# EAGLE schematic 2020can_slave_v3 (EAGLE 9.6.2)
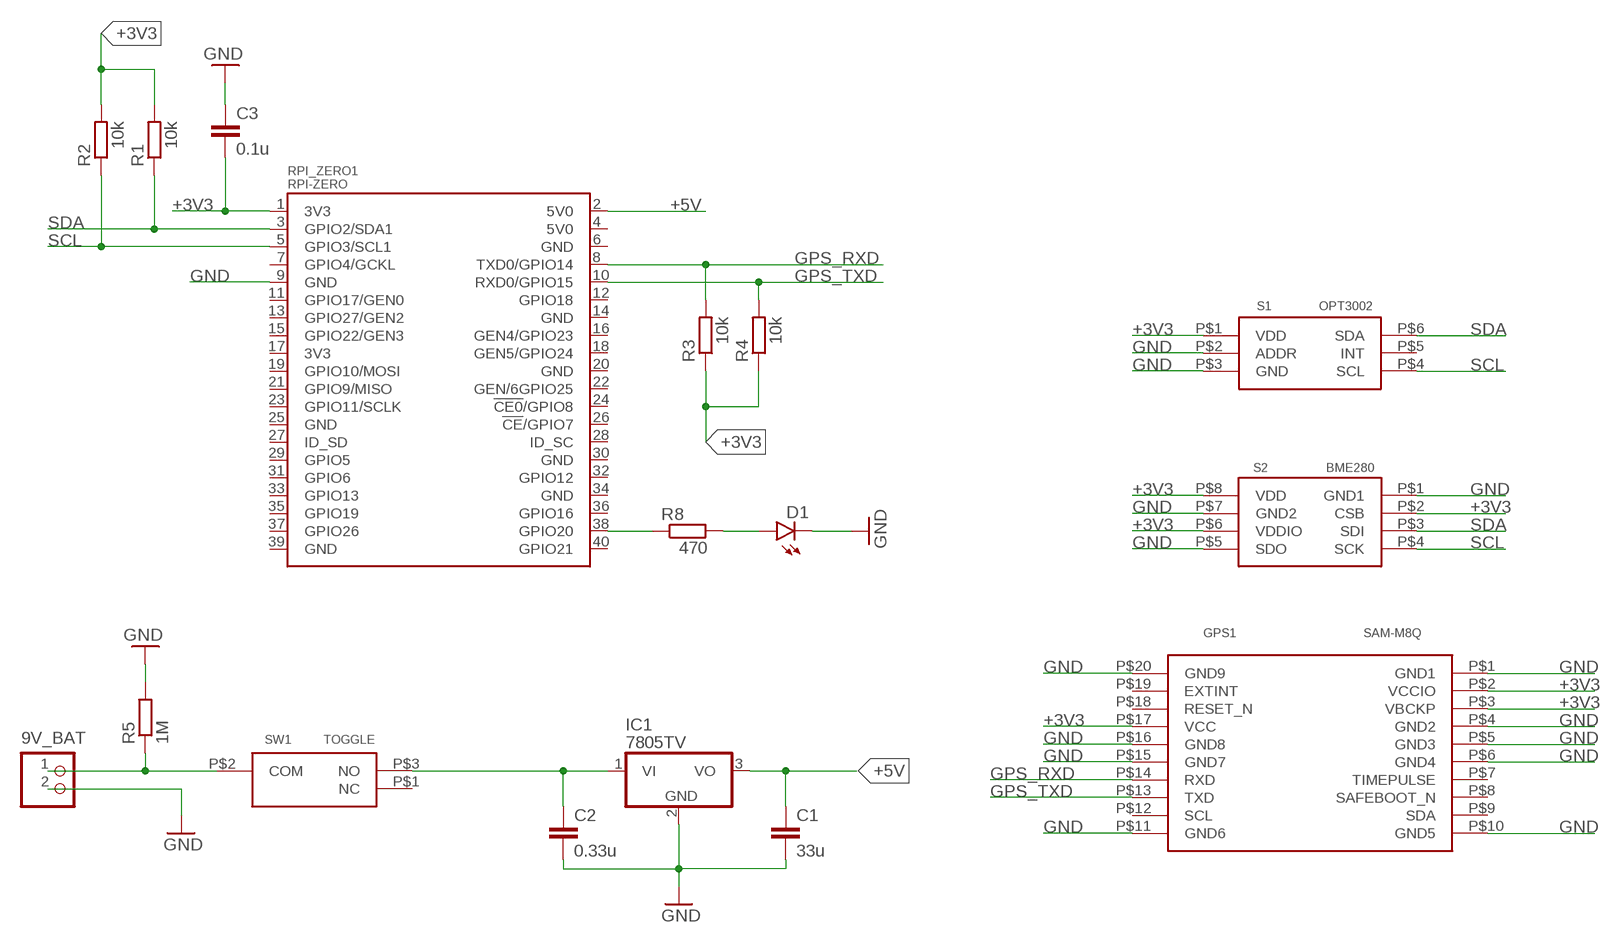
[diagram p0: schematic, sheet 1]

## Parts
9V_BAT  B2P-VH  [B2P-VH]
C1  33u  C5/3  [C5B3]
C2  0.33u  C5/3  [C5B3]
C3  0.1u  C-EUC1206  [C1206]
D1  SFH482  [SFH482]
GPS1  SAM-M8Q  [SAM-M8Q]
IC1  7805TV  [TO220V]
R1  10k  R-EU_R1206  [R1206]
R2  10k  R-EU_R1206  [R1206]
R3  10k  R-EU_R1206  [R1206]
R4  10k  R-EU_R1206  [R1206]
R5  1M  R-EU_0207/10  [0207/10]
R8  470  R-EU_0207/10  [0207/10]
RPI_ZERO1  RPI-ZERO  [RASP_PI_ZERO_BOARD_FULL]
S1  OPT3002  [OPT3002]
S2  BME280  [BME280]
SW1  TOGGLE  TOGGLE_1MS1-T1-B1-M2-Q-N-S  [TOGGLE_1MS1-T1-B1-M2-Q-N-S]

## Nets
+3V3 [sensor]: C3.2 GPS1.P$2(VCCIO) GPS1.P$3(VBCKP) GPS1.P$17(VCC) R1.2 R2.2 R3.1 R4.1 RPI_ZERO1.1(3V3) S1.P$1(VDD) S2.P$2(CSB) S2.P$6(VDDIO) S2.P$8(VDD)
+5V [supply]: C1.1 IC1.3(VO) RPI_ZERO1.2(5V0)
GND [supply]: 9V_BAT.2 C1.2 C2.2 C3.1 D1.K(C) GPS1.P$1(GND1) GPS1.P$4(GND2) GPS1.P$5(GND3) GPS1.P$6(GND4) GPS1.P$10(GND5) GPS1.P$11(GND6) GPS1.P$15(GND7) GPS1.P$16(GND8) GPS1.P$20(GND9) IC1.2(GND) R5.2 RPI_ZERO1.9(GND) S1.P$2(ADDR) S1.P$3(GND) S2.P$1(GND1) S2.P$5(SDO) S2.P$7(GND2)
GPS_RXD: GPS1.P$14(RXD) R3.2 RPI_ZERO1.8(TXD0/GPIO14)
GPS_TXD: GPS1.P$13(TXD) R4.2 RPI_ZERO1.10(RXD0/GPIO15)
N$1: R8.1 RPI_ZERO1.38(GPIO20)
N$2: D1.A R8.2
SCL: R2.1 RPI_ZERO1.5(GPIO3/SCL1) S1.P$4(SCL) S2.P$4(SCK)
SDA: R1.1 RPI_ZERO1.3(GPIO2/SDA1) S1.P$6(SDA) S2.P$3(SDI)
V+ [supply]: 9V_BAT.1 R5.1 SW1.P$2(COM)
VIN [supply]: C2.1 IC1.1(VI) SW1.P$3(NO)
Unconnected: GPS1.P$7(TIMEPULSE) GPS1.P$8(SAFEBOOT_N) GPS1.P$9(SDA) GPS1.P$12(SCL) GPS1.P$18(RESET_N) GPS1.P$19(EXTINT) RPI_ZERO1.4(5V0) RPI_ZERO1.6(GND) RPI_ZERO1.7(GPIO4/GCKL) RPI_ZERO1.11(GPIO17/GEN0) RPI_ZERO1.12(GPIO18) RPI_ZERO1.13(GPIO27/GEN2) RPI_ZERO1.14(GND) RPI_ZERO1.15(GPIO22/GEN3) RPI_ZERO1.16(GEN4/GPIO23) RPI_ZERO1.17(3V3) RPI_ZERO1.18(GEN5/GPIO24) RPI_ZERO1.19(GPIO10/MOSI) RPI_ZERO1.20(GND) RPI_ZERO1.21(GPIO9/MISO) RPI_ZERO1.22(GEN/6GPIO25) RPI_ZERO1.23(GPIO11/SCLK) RPI_ZERO1.24(!CE0!/GPIO8) RPI_ZERO1.25(GND) RPI_ZERO1.26(!CE!/GPIO7) RPI_ZERO1.27(ID_SD) RPI_ZERO1.28(ID_SC) RPI_ZERO1.29(GPIO5) RPI_ZERO1.30(GND) RPI_ZERO1.31(GPIO6) RPI_ZERO1.32(GPIO12) RPI_ZERO1.33(GPIO13) RPI_ZERO1.34(GND) RPI_ZERO1.35(GPIO19) RPI_ZERO1.36(GPIO16) RPI_ZERO1.37(GPIO26) RPI_ZERO1.39(GND) RPI_ZERO1.40(GPIO21) S1.P$5(INT) SW1.P$1(NC)

## Library data of the parts
9V_BAT = CONN_VH:B2P-VH: Wire-to-Board 3.96mm pitch top mount connector Source: http://www.jst-mfg.com/product/pdf/jpn/VH.pdf http://www.jst-mfg.com/product/detail.php?series=262
C1 C2 = capacitor-wima:C: CAPACITOR naming: grid - package width
C3 = rcl:C-EU: CAPACITOR, European symbol; SPICEPREFIX: C
D1 = led:SFH482: IR LED infrared emitting diode, Infineon
GPS1 = GPS:SAM-M8Q
IC1 = linear:78*: Positive VOLTAGE REGULATOR Source: http://cache.national.com/ds/LM/LM78L05.pdf http://www.fairchildsemi.com/ds/LM/LM7805.pdf
R1-R5 R8 = rcl:R-EU_: RESISTOR, European symbol; SPICEPREFIX: R
RPI_ZERO1 = RaspberryPi_Zero:RPI-ZERO: MICON
S1 = OPT3002:OPT3002
S2 = BME280:BME280
SW1 = switch:TOGGLE_1MS1-T1-B1-M2-Q-N-S

## Net classes
1 supply: width 1 mm, clearance 0.2 mm
2 sensor: width 0.3 mm, clearance 0.2 mm